# EasyEDA schematic CircuitPython Macro Keyboard.json

## Sheets
1 LOLIN S2: TITLE: LOLIN S2 Mini; REV: 1.0; Date: 2024-05-25; Sheet: 1/1; Drawn By: dasougon7; Company: Your Company
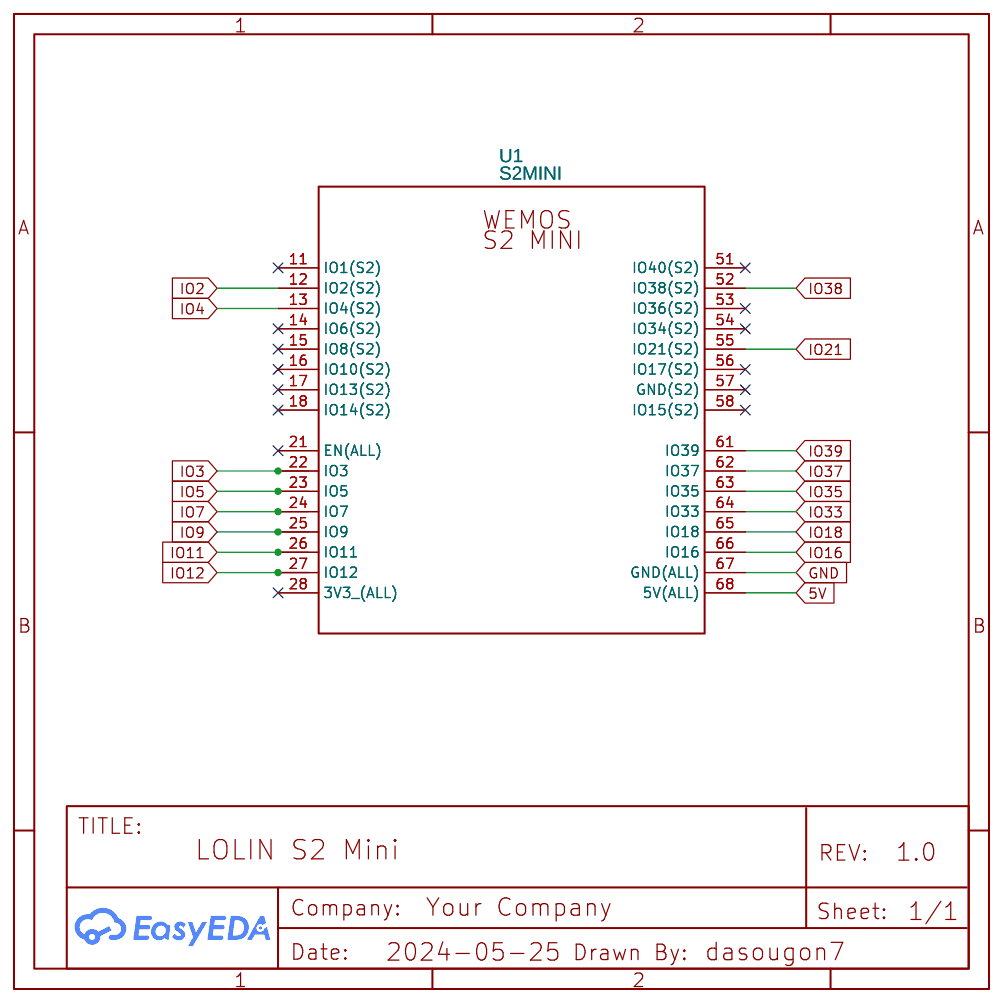
[diagram p0: LOLIN S2]
2 Button Matrix: TITLE: Button & LED Matrix; Date: 2024-09-25
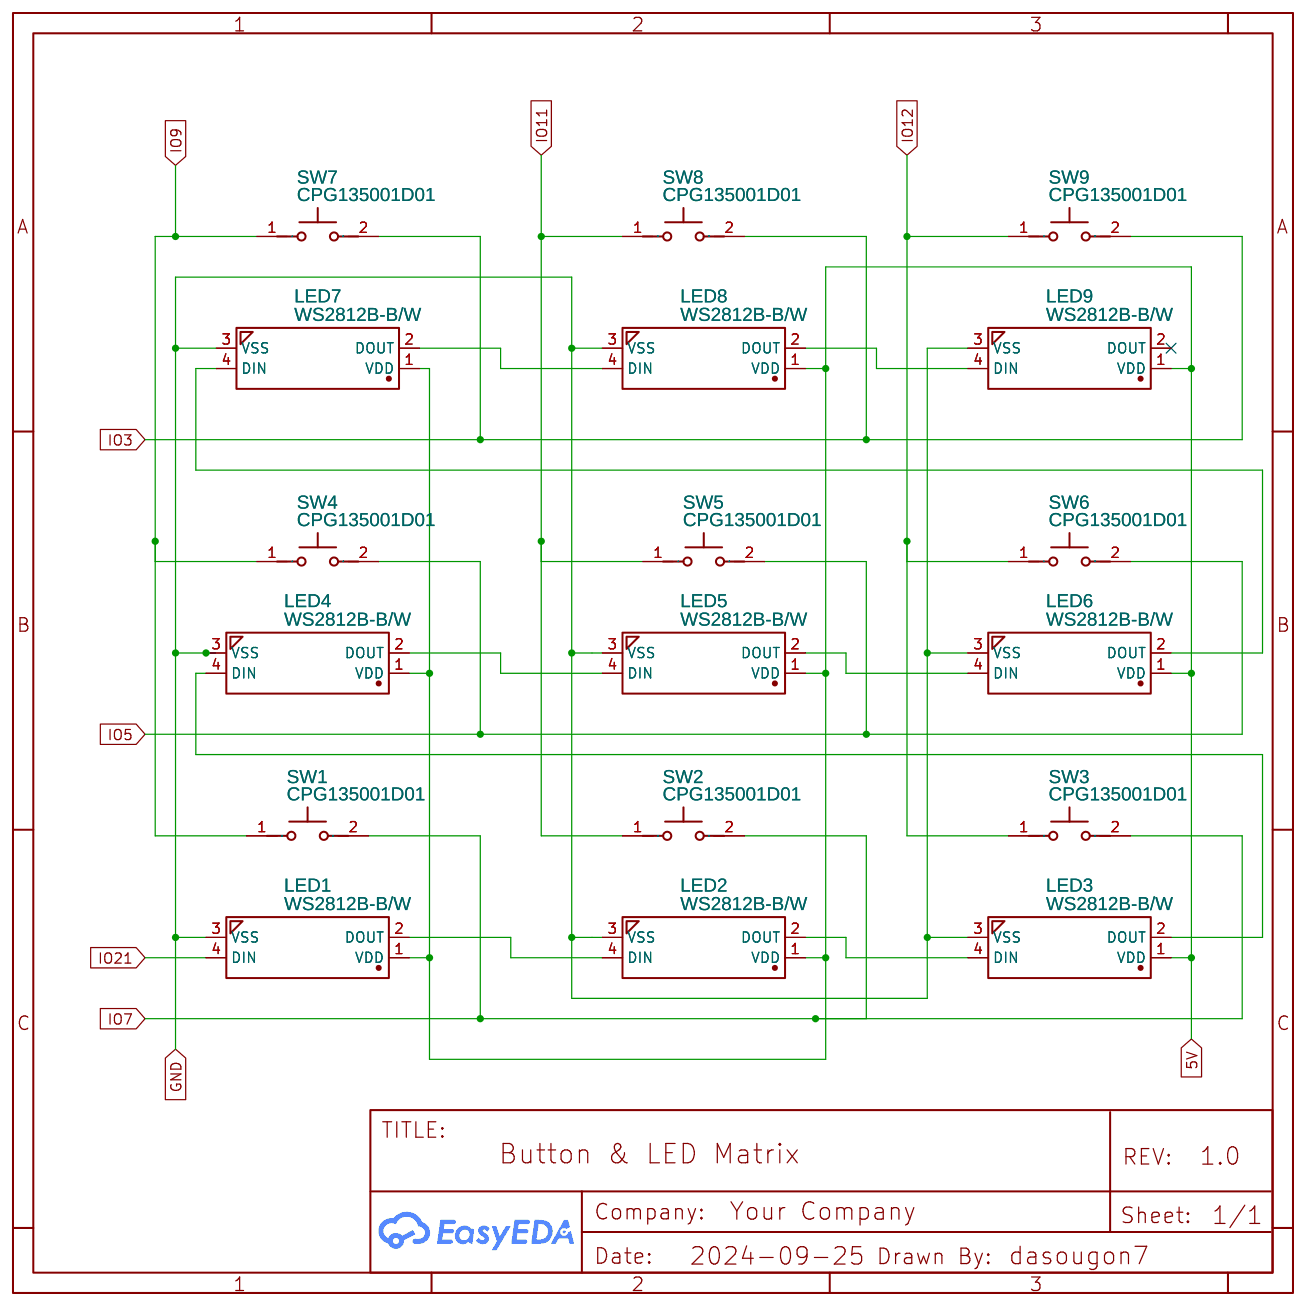
[diagram p1: Button Matrix]
3 LCD1602: TITLE: Sheet_1; Date: 2024-05-30
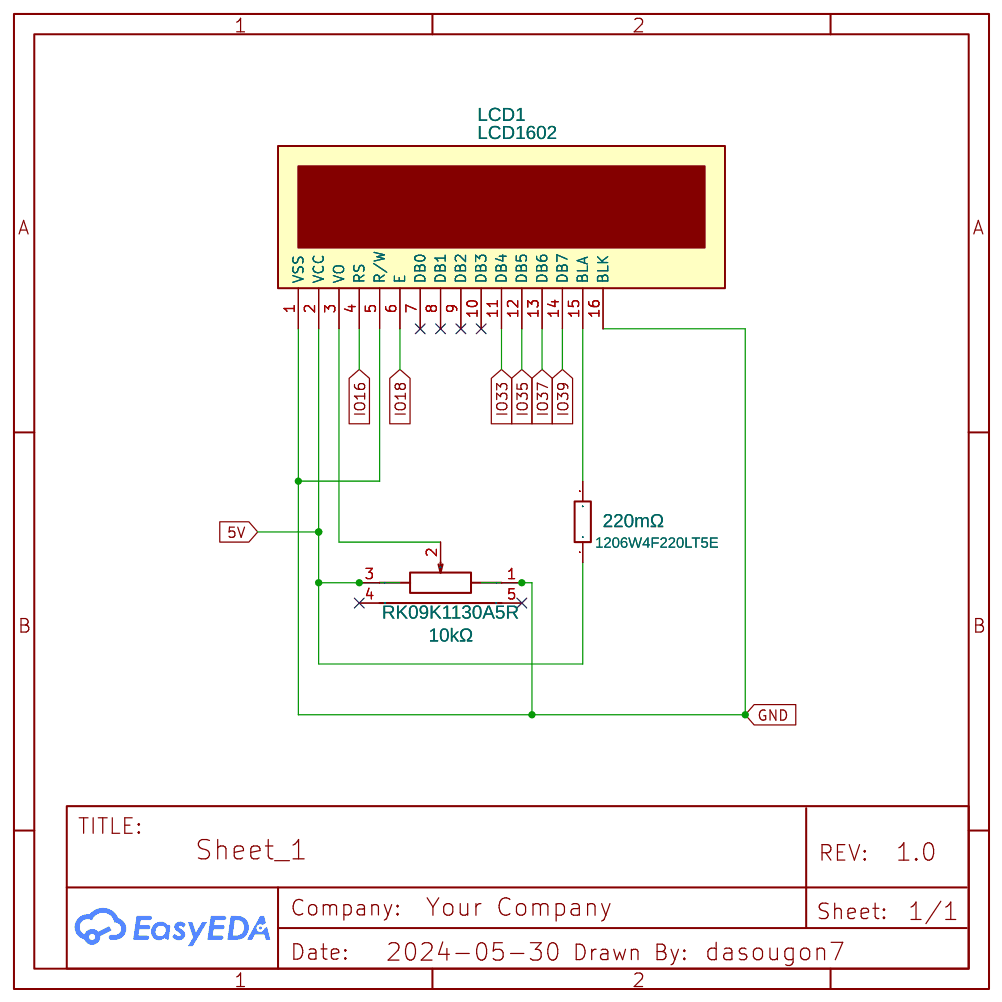
[diagram p2: LCD1602]
4 Rotary Encoder: TITLE: Sheet_1; Date: 2024-10-03
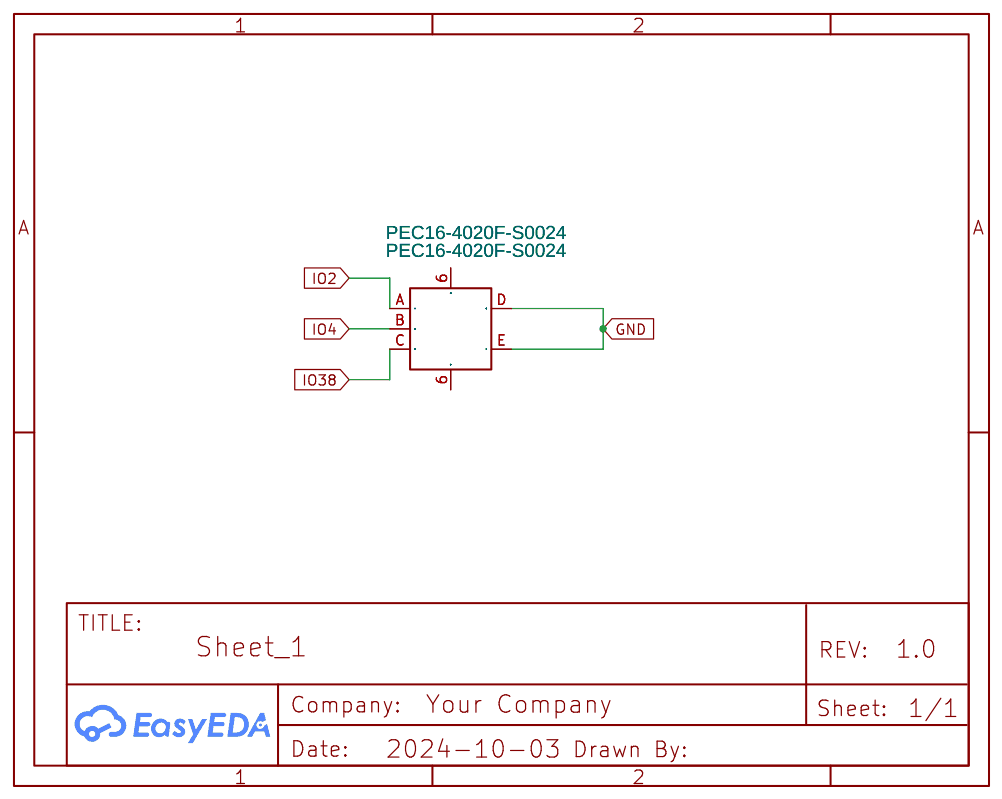
[diagram p3: Rotary Encoder]

## Parts
sheet Button Matrix
LED1  WS2812B-B/W  [LED-SMD_4P-L5.0-W5.0-TL_WS2812B-B]
LED2  WS2812B-B/W  [LED-SMD_4P-L5.0-W5.0-TL_WS2812B-B]
LED3  WS2812B-B/W  [LED-SMD_4P-L5.0-W5.0-TL_WS2812B-B]
LED4  WS2812B-B/W  [LED-SMD_4P-L5.0-W5.0-TL_WS2812B-B]
LED5  WS2812B-B/W  [LED-SMD_4P-L5.0-W5.0-TL_WS2812B-B]
LED6  WS2812B-B/W  [LED-SMD_4P-L5.0-W5.0-TL_WS2812B-B]
LED7  WS2812B-B/W  [LED-SMD_4P-L5.0-W5.0-TL_WS2812B-B]
LED8  WS2812B-B/W  [LED-SMD_4P-L5.0-W5.0-TL_WS2812B-B]
LED9  WS2812B-B/W  [LED-SMD_4P-L5.0-W5.0-TL_WS2812B-B]
SW1  CPG135001D01  [KEY-TH_CPG135001D0X]
SW2  CPG135001D01  [KEY-TH_CPG135001D0X]
SW3  CPG135001D01  [KEY-TH_CPG135001D0X]
SW4  CPG135001D01  [KEY-TH_CPG135001D0X]
SW5  CPG135001D01  [KEY-TH_CPG135001D0X]
SW6  CPG135001D01  [KEY-TH_CPG135001D0X]
SW7  CPG135001D01  [KEY-TH_CPG135001D0X]
SW8  CPG135001D01  [KEY-TH_CPG135001D0X]
SW9  CPG135001D01  [KEY-TH_CPG135001D0X]
sheet LCD1602
1206W4F220LT5E  220mΩ  [R1206]
LCD1  LCD1602  [LCD1602]
RK09K1130A5R  10kΩ  [RES-ADJ-TH_RK09K1130A5R]
sheet LOLIN S2
U1  S2MINI  [S2MINI]
sheet Rotary Encoder
PEC16-4020F-S0024  PEC16-4020F-S0024  [SW-TH_PEC16-4020F-S0024]

## Library data of the parts
LED1-LED9 = WS2812B-B/W: Contributor: LCSC; Supplier: LCSC; Supplier Part: C2761795; Manufacturer: worldsemi; Manufacturer Part: WS2812B-B/T; JLCPCB Part Class: Extended Part
SW1-SW9 = CPG135001D01: Contributor: LCSC; Supplier: LCSC; Supplier Part: C400229; Manufacturer: Kailh(凯华); JLCPCB Part Class: Extended Part
1206W4F220LT5E = 1206W4F220LT5E: Supplier: LCSC; Manufacturer: UNI-ROYAL(厚声); Supplier Part: C25336; JLCPCB Part Class: Extended Part
LCD1 = LCD1602: Manufacturer: HS(汉昇); Manufacturer Part: HS1602A-Y; Supplier Part: C18198250; Supplier: LCSC; Contributor: LCEDA_Lib
RK09K1130A5R = RK09K1130A5R: Contributor: LCSC; Supplier: LCSC; Supplier Part: C209779; Manufacturer: ALPSALPINE(阿尔卑斯阿尔派); JLCPCB Part Class: Extended Part; link: https://lcsc.com/eda_search?q=C209779&%26type=1&ref=editor
U1 = S2MINI: Manufacturer: WEMOS; Manufacturer Part: Wemos; Supplier: WEMOS; Supplier Part: WEMOS_S2_MINI; link: https://www.wemos.cc/en/latest/s2/s2_mini.html?spm=a2g0o.detail.1000023.1.36da1596ZoDwKF; Contributor: sergiy_gurin
PEC16-4020F-S0024 = PEC16-4020F-S0024: Contributor: LCSC; Supplier: LCSC; Supplier Part: C143803; Manufacturer: BOURNS; JLCPCB Part Class: Extended Part; link: https://lcsc.com/eda_search?q=C143803&%26type=1&ref=editor

## Nets
5V: 1206W4F220LT5E.1 LCD1.2(VCC) LED1.1(VDD) LED2.1(VDD) LED3.1(VDD) LED4.1(VDD) LED5.1(VDD) LED6.1(VDD) LED7.1(VDD) LED8.1(VDD) LED9.1(VDD) RK09K1130A5R.3 U1.68(5V(ALL))
GND: LCD1.1(VSS) LCD1.5(R/W) LCD1.16(BLK) LED1.3(VSS) LED2.3(VSS) LED3.3(VSS) LED4.3(VSS) LED5.3(VSS) LED6.3(VSS) LED7.3(VSS) LED8.3(VSS) LED9.3(VSS) PEC16-4020F-S0024.D PEC16-4020F-S0024.E RK09K1130A5R.1 U1.67(GND(ALL))
IO2: PEC16-4020F-S0024.A U1.12(IO2(S2))
IO3: SW7.2 SW8.2 SW9.2 U1.22(IO3)
IO4: PEC16-4020F-S0024.B U1.13(IO4(S2))
IO5: SW4.2 SW5.2 SW6.2 U1.23(IO5)
IO7: SW1.2 SW2.2 SW3.2 U1.24(IO7)
IO9: SW1.1 SW4.1 SW7.1 U1.25(IO9)
IO11: SW2.1 SW5.1 SW8.1 U1.26(IO11)
IO12: SW3.1 SW6.1 SW9.1 U1.27(IO12)
IO16: LCD1.4(RS) U1.66(IO16)
IO18: LCD1.6(E) U1.65(IO18)
IO21: LED1.4(DIN) U1.55(IO21(S2))
IO33: LCD1.11(DB4) U1.64(IO33)
IO35: LCD1.12(DB5) U1.63(IO35)
IO37: LCD1.13(DB6) U1.62(IO37)
IO38: PEC16-4020F-S0024.C U1.52(IO38(S2))
IO39: LCD1.14(DB7) U1.61(IO39)
Net-(1206W4F220LT5E-2): 1206W4F220LT5E.2 LCD1.15(BLA)
Net-(LCD1-3): LCD1.3(VO) RK09K1130A5R.2
Net-(LED1-2): LED1.2(DOUT) LED2.4(DIN)
Net-(LED2-2): LED2.2(DOUT) LED3.4(DIN)
Net-(LED3-2): LED3.2(DOUT) LED4.4(DIN)
Net-(LED4-2): LED4.2(DOUT) LED5.4(DIN)
Net-(LED5-2): LED5.2(DOUT) LED6.4(DIN)
Net-(LED6-2): LED6.2(DOUT) LED7.4(DIN)
Net-(LED7-2): LED7.2(DOUT) LED8.4(DIN)
Net-(LED8-2): LED8.2(DOUT) LED9.4(DIN)

Not connected (* = marked no-connect by the designer): LCD1 7(DB0)* 8(DB1)* 9(DB2)* 10(DB3)*; LED9 2(DOUT)*; PEC16-4020F-S0024 6; RK09K1130A5R 4(EH)* 5(EH)*; U1 11(IO1(S2))* 14(IO6(S2))* 15(IO8(S2))* 16(IO10(S2))* 17(IO13(S2))* 18(IO14(S2))* 21(EN(ALL))* 28(3V3 (ALL))* 51(IO40(S2))* 53(IO36(S2))* 54(IO34(S2))* 56(IO17(S2))* 57(GND(S2))* 58(IO15(S2))*
